# Altium schematic sheet GPIO.SchDoc: APTOMAT - Power Supply
size A4; Revision: 1.1.1; SheetNumber: 5; SheetTotal: 5; DrawnBy: KJP; ProjectNumber: 4397; PCBRevision: 0071KJP; DocumentSize: A4; PCAName: PCA10040; PCBNumber: 400150; ProjectName: Quark
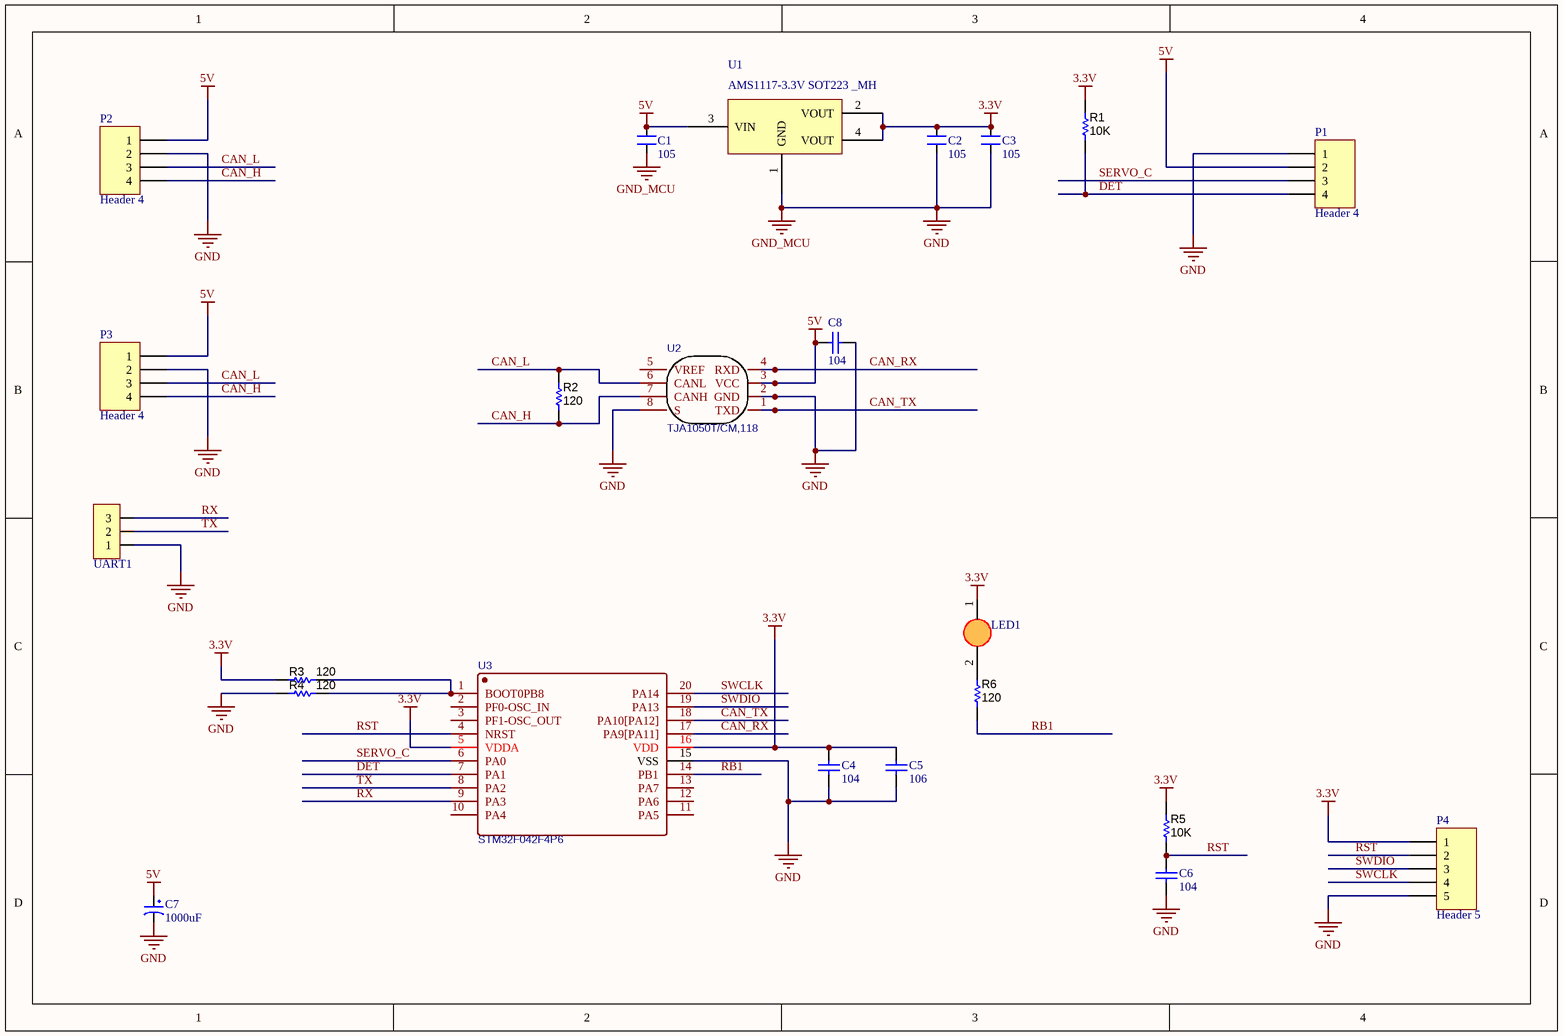
[diagram p0: GPIO.SchDoc]

## Parts
C1  105  [0805_HV]
C2  105  [0805_HV]
C3  105  [0805_HV]
C4  104  [0805_HV]
C5  106  [0805_HV]
C6  104  [0805_HV]
C7  1000uF  [TU_NHOM_470uF_25V_MH]
C8  104  [0805_HV]
LED1  LED3  [LED_0805]  (value not drawn)
P1  Header 4  [SpringCON]
P2  Header 4  [JST-PH2.00-4P]
P3  Header 4  [JST-PH2.00-4P]
P4  Header 5  [HDR1X5]
R1  10K  [Tro SMD 0805]
R2  120  [0805_HV]
R3  120  [0805_HV]
R4  120  [0805_HV]
R5  10K  [0805_HV]
R6  120  [0805_HV]
U1  AMS1117-3.3V SOT223 _MH  [SOT223]
U2  TJA1050T/CM,118  [SOP 8]
U3  STM32F042F4P6  [TSSOP20]
UART1  Header 3_MH  [HEADER 3]  (value not drawn)

## Nets
3.3V: C2.2 C3.2 C4.2 C5.2 LED1.1(A) P4.1 R1.1 R3.1 R5.2 U1.2(VOUT) U1.4(VOUT) U3.5(VDDA) U3.16(VDD)
5V: C1.2 C7.1 C8.2 P1.2 P2.1 P3.1 U1.3(VIN) U2.3(VCC)
GND: C1.1 C2.1 C3.1 C4.1 C5.1 C6.1 C7.2 C8.1 P1.1 P2.2 P3.2 P4.5 R4.1 U1.1(GND) U2.2(GND) U2.8(S) U3.15(VSS) UART1.1  [also labelled GND_MCU]
CAN_H: P2.4 P3.4 R2.2 U2.7(CANH)
CAN_L: P2.3 P3.3 R2.1 U2.6(CANL)
CAN_RX: U2.4(RXD) U3.17(PA9[PA11])
CAN_TX: U2.1(TXD) U3.18(PA10[PA12])
DET: P1.4 R1.2 U3.7(PA1)
RB1: R6.2 U3.14(PB1)
RST: C6.2 P4.2 R5.1 U3.4(NRST)
RX: U3.9(PA3) UART1.3
SERVO_C: P1.3 U3.6(PA0)
SWCLK: P4.4 U3.20(PA14)
SWDIO: P4.3 U3.19(PA13)
TX: U3.8(PA2) UART1.2
NetLED1_2: LED1.2(K) R6.1
NetR3_2: R3.2 R4.2 U3.1(BOOT0PB8)

Not connected (* = marked no-connect by the designer): U2 5(VREF); U3 2(PF0-OSC_IN) 3(PF1-OSC_OUT) 10(PA4) 11(PA5) 12(PA6) 13(PA7)

## Library data of the parts
C1-C3 = CM: Cap SMD; Value: 103
C4-C6 C8 = Capacitor 0805: Ceramic Chip Capacitor - Standard; Note: Footprint corresponds to dimensions for bulk cassette packaging. This case size has tightened tolerances.; Published: 17-Jul-2002; LatestRevisionDate: 19-Mar-2004; LatestRevisionNote: Silkscreen size reduced.; DatasheetDocument: Mar-2001; PackageDocument: Mar-2001; PackageReference: 0805; Publisher: Altium Limited; Code_JEITA: 0805; Code_IPC: 2012[0805]; ComponentLink1Description: Manufacturer Link; ComponentLink1URL: http://www.kemet.com/; ComponentLink2Description: Datasheet; ComponentLink2URL: http://www.kemet.com/kemet/web/homepage/kechome.nsf/vapubfilesname/F3102TA.pdf/$file/F3102TA.pdf
  C4 C6 C8: Value: 104
  C5: Value: 106
C7 = TU_NHOM_1000uF_16V_MH: Value: 47uF/16 - 50V; Description 1: 470uF/6,3V - 330uF/10V - 220uF/16V; Description 2: 100uF/25V - 35V - 47uF/50V - 22uF/100V; Description 3: 33uF => 47uF/63V - 1uF => 4,7uF/160V; Description 4: 1uF => 2,2uF/250V - 1uF/350V
LED1 = LED SMD_0805_MH: LED 3mm
P1-P3 = Header 4: Header, 4-Pin; LatestRevisionDate: 17-Jul-2002; LatestRevisionNote: Re-released for DXP Platform.; Publisher: Altium Limited
P4 = Header 5: Header, 5-Pin; LatestRevisionDate: 17-Jul-2002; LatestRevisionNote: Re-released for DXP Platform.; Publisher: Altium Limited
R1-R6 = R nho: RES, 100, 1%, 0.1 W, 0402; PartNumber: ERJ-2RKF1000X; Manufacturer: Panasonic; CompType: Resistor; Res_ohm: 100; Value_Code: 100R; Tolerance_%: 1; Power_W: 0.1; Value2: 0.1W; VDC_V: 50; TempCo: 100 ppm/C; EIA_Code: E96; U/M: EA; AEC Category: Q200; SymbolVersion: 2009-05-29; PackageReference: 0402; RoHS: Y; Value1: 1%; MountType: SMT; Technology: Thick Film; Published: 2008-06-26; Publisher: Texas Instruments; LatestRevisionDate: 2016-01-08; ComponentLink1Description: Datasheet link; ComponentLink1URL: http://industrial.panasonic.com/www-data/pdf/AOA0000/AOA0000CE2.pdf; Supplier 1: Digi-Key; Supplier Part Number 1: P100LCT-ND; Supplier 2: Mouser; Supplier Part Number 2: 667-ERJ-2RKF1000X; Supplier 3: Farnell; Supplier Part Number 3: 2304034; AEC Qualified: ?
  R1 R5: Value: 10K
  R2-R4 R6: Value: 120
U2 = TJA1050T/CM,118: BOM_Manufacturer: NXP; SMT Type: Basic; BOM_Supplier: LCSC; BOM_Manufacturer Part: TJA1050T/CM,118; BOM_LCSC Assembly: Yes; image: //image.lceda.cn/szlcsc/C6952.jpg; BOM_Supplier Part: C6952; spicePre: U
U3 = STM32F042F4P6: BOM_Manufacturer: STMicroelectronics; BOM_Supplier: LCSC; BOM_Manufacturer Part: STM32F042F4P6; BOM_Supplier Part: C81002; spicePre: U
UART1 = Header 3_MH: Header 3P XH2.54 thẳng